# EAGLE design input output buffers DLFO (EAGLE 9.6.2)
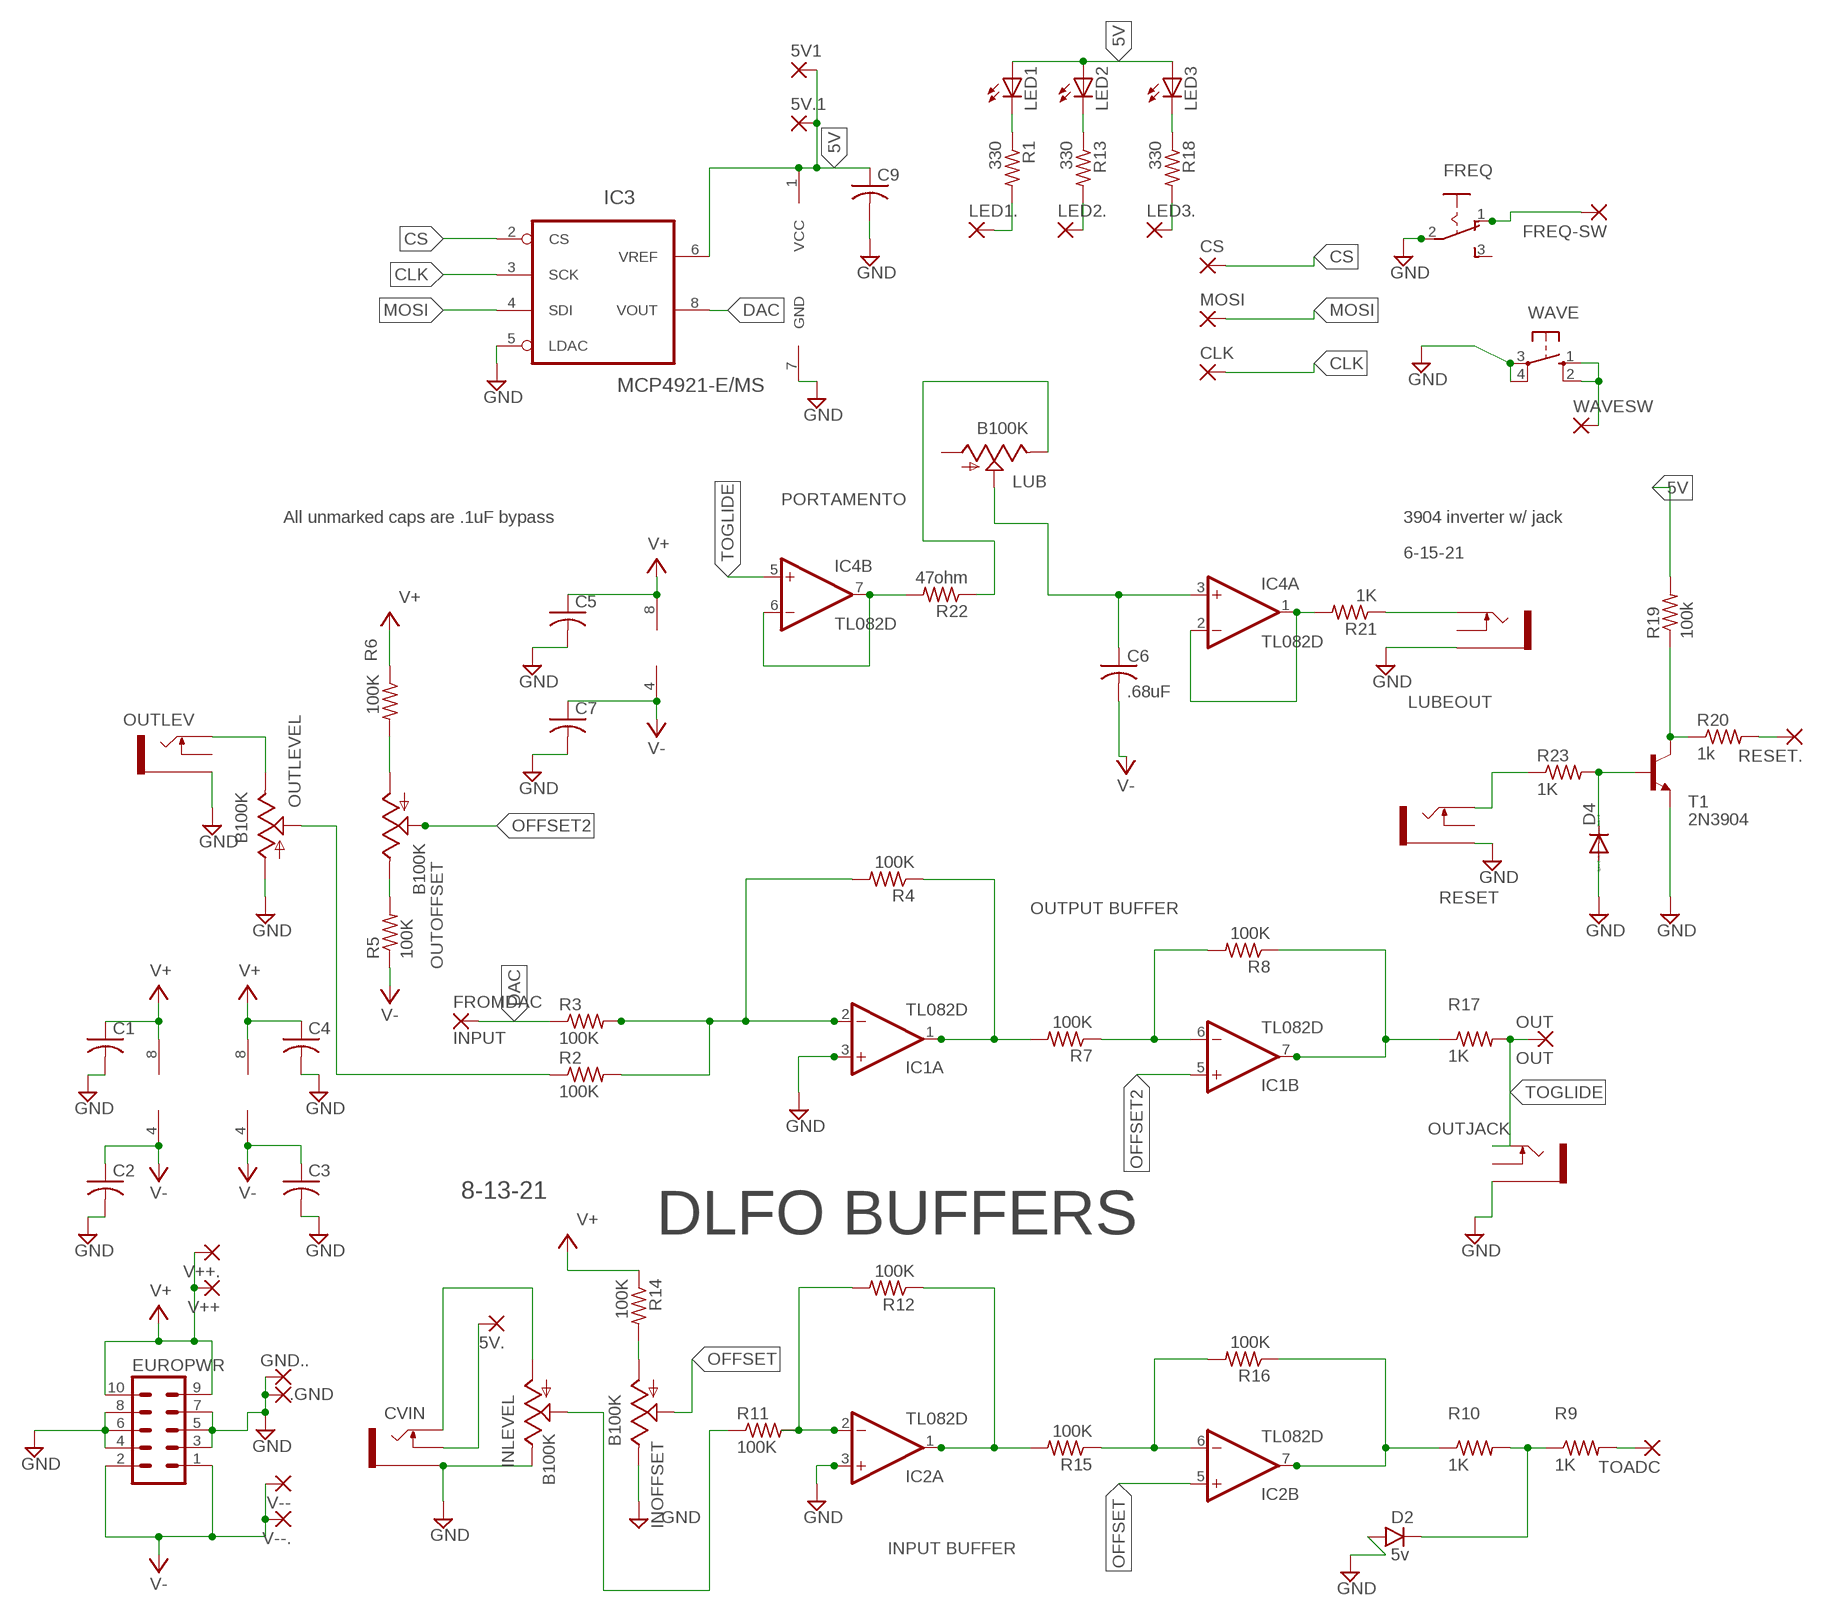
[diagram p0: schematic, sheet 1]

## Parts
5V1  WIREPAD2,54/1,0  [2,54/1,0]
5V.  3,17/1,3  [3,17/1,3]
5V.1  WIREPAD2,54/1,0  [2,54/1,0]
.GND  3,17/1,3  [3,17/1,3]
C1  C-USC0603  [C0603]
C2  C-USC0603  [C0603]
C3  C-USC0603  [C0603]
C4  C-USC0603  [C0603]
C5  C-USC0603  [C0603]
C6  .68uF  C-US050-024X044  [C050-024X044]
C7  C-USC0603  [C0603]
C9  C-USC0603  [C0603]
CLK  WIREPAD2,54/1,1  [2,54/1,1]
CS  WIREPAD2,54/1,0  [2,54/1,0]
CVIN  THONKICONNNEW  [WQP-PJ301M-12_JACK]
D2  5v  DO41.2  [DO41-2]
D4  1N4148DO35-10  [DO35-10]
EUROPWR  EURO_POWER_HEADERREGULAR  [EURO_POWER_HEADER]
FREQ  M251  [M251]
FREQ-SW  WIREPAD2,54/0,9  [2,54/0,9]
FROMDAC  INPUT  3,17/1,3  [3,17/1,3]
GND..  3,17/1,3  [3,17/1,3]
IC1  TL082D  [SO08]
IC2  TL082D  [SO08]
IC3  MCP4921-E/MS  [MSOP-8]
IC4  TL082D  [SO08]
INLEVEL  B100K  9MM_SNAP-IN_POT_  [9MM_SNAP-IN_POT]
INOFFSET  B100K  9MM_SNAP-IN_POT_  [9MM_SNAP-IN_POT]
LED1  LED3MM  [LED3MM]
LED1.  WIREPAD2,54/1,0  [2,54/1,0]
LED2  LED3MM  [LED3MM]
LED2.  WIREPAD2,54/1,0  [2,54/1,0]
LED3  LED3MM  [LED3MM]
LED3.  WIREPAD2,54/1,1  [2,54/1,1]
LUB  B100K  9MM_SNAP-IN_POT_  [9MM_SNAP-IN_POT]
LUBEOUT  THONKICONNNEW  [WQP-PJ301M-12_JACK]
MOSI  WIREPAD2,54/1,0  [2,54/1,0]
OUT  OUT  3,17/1,3  [3,17/1,3]
OUTJACK  THONKICONNNEW  [WQP-PJ301M-12_JACK]
OUTLEV  THONKICONNNEW  [WQP-PJ301M-12_JACK]
OUTLEVEL  B100K  9MM_SNAP-IN_POT_  [9MM_SNAP-IN_POT]
OUTOFFSET  B100K  9MM_SNAP-IN_POT_  [9MM_SNAP-IN_POT]
R1  330  R-US_R0603  [R0603]
R2  100K  R-US_R0603  [R0603]
R3  100K  R-US_R0603  [R0603]
R4  100K  R-US_R0603  [R0603]
R5  100K  R-US_R0603  [R0603]
R6  100K  R-US_R0603  [R0603]
R7  100K  R-US_R0603  [R0603]
R8  100K  R-US_R0603  [R0603]
R9  1K  R-US_R0603  [R0603]
R10  1K  R-US_R0603  [R0603]
R11  100K  R-US_R0603  [R0603]
R12  100K  R-US_R0603  [R0603]
R13  330  R-US_R0603  [R0603]
R14  100K  R-US_R0603  [R0603]
R15  100K  R-US_R0603  [R0603]
R16  100K  R-US_R0603  [R0603]
R17  1K  R-US_R0603  [R0603]
R18  330  R-US_R0603  [R0603]
R19  100k  R-US_R0603  [R0603]
R20  1k  R-US_R0603  [R0603]
R21  1K  R-US_R0603  [R0603]
R22  47ohm  R-US_R0603  [R0603]
R23  1K  R-US_R0603  [R0603]
RESET  THONKICONNNEW  [WQP-PJ301M-12_JACK]
RESET.  3,17/1,3  [3,17/1,3]
T1  2N3904  [TO92]
TOADC  3,17/1,3  [3,17/1,3]
V++  3,17/1,3  [3,17/1,3]
V++.  3,17/1,3  [3,17/1,3]
V--  3,17/1,3  [3,17/1,3]
V--.  3,17/1,3  [3,17/1,3]
WAVE  10-XX  [B3F-10XX]
WAVESW  WIREPAD2,54/0,9  [2,54/0,9]

## Nets
5V: 5V1.1(P) 5V.1.1(P) C9.1 IC3.1(VCC) IC3.6(VREF) LED1.A LED2.A LED3.A R19.2
CLK: CLK.1(P) IC3.3(SCK)
CS: CS.1(P) IC3.2(CS)
DAC: FROMDAC.1(P) IC3.8(VOUT) R3.1
GND: .GND.1(P) C1.2 C2.2 C3.2 C4.2 C5.2 C7.2 C9.2 CVIN.P$3_SLEEVE(SLEEVE) D2.A D4.A EUROPWR.3 EUROPWR.4 EUROPWR.5 EUROPWR.6 EUROPWR.7 EUROPWR.8 FREQ.2(P) GND...1(P) IC1.3(A:+IN) IC2.3(A:+IN) IC3.5(LDAC) IC3.7(GND) INLEVEL.3(E) INOFFSET.3(E) LUBEOUT.P$3_SLEEVE(SLEEVE) OUTJACK.P$3_SLEEVE(SLEEVE) OUTLEV.P$3_SLEEVE(SLEEVE) OUTLEVEL.1(A) RESET.P$3_SLEEVE(SLEEVE) T1.3(E) WAVE.3(P) WAVE.4(P1)
LED1: LED1..1(P) R1.2
LED2: LED2..1(P) R13.2
MOSI: IC3.4(SDI) MOSI.1(P)
N$1: OUTLEV.P$1_TIP(TIP) OUTLEVEL.3(E)
N$2: IC1.6(B:-IN) R7.1 R8.2
N$3: IC1.1(A:OUT) R4.1 R7.2
N$4: INOFFSET.1(A) R14.2
N$5: D2.C R9.1 R10.2
N$6: IC2.2(A:-IN) R11.2 R12.2
N$7: OUTLEVEL.2(S) R2.1
N$8: OUTOFFSET.1(A) R6.2
N$9: OUTOFFSET.3(E) R5.2
N$10: IC2.1(A:OUT) R12.1 R15.2
N$11: IC1.7(B:OUT) R8.1 R17.1
N$12: R23.1 RESET.P$1_TIP(TIP)
N$13: CVIN.P$1_TIP(TIP) INLEVEL.1(A)
N$14: D4.C R23.2 T1.2(B)
N$15: IC2.6(B:-IN) R15.1 R16.2
N$16: IC2.7(B:OUT) R10.1 R16.1
N$17: IC1.2(A:-IN) R2.2 R3.2 R4.2
N$18: LED3..1(P) R18.2
N$19: R9.2 TOADC.1(P)
N$20: INLEVEL.2(S) R11.1
N$21: LED1.K(C) R1.1
N$22: WAVE.1(S) WAVE.2(S1) WAVESW.1(P)
N$23: LED2.K(C) R13.1
N$24: FREQ-SW.1(P) FREQ.1(O)
N$25: LED3.K(C) R18.1
N$26: R19.1 R20.1 T1.1(C)
N$27: 5V..1(P) CVIN.P$2_SWITCH(SWITCH)
N$28: IC4.6(B:-IN) IC4.7(B:OUT) R22.2
N$29: IC4.1(A:OUT) IC4.2(A:-IN) R21.2
N$30: LUBEOUT.P$1_TIP(TIP) R21.1
N$31: LUB.3(E) R22.1
N$32: C6.1 IC4.3(A:+IN) LUB.2(S)
N$33: R20.2 RESET..1(P)
OFFSET: IC2.5(B:+IN) INOFFSET.2(S)
OFFSET2: IC1.5(B:+IN) OUTOFFSET.2(S)
TOGLIDE: IC4.5(B:+IN) OUT.1(P) OUTJACK.P$1_TIP(TIP) R17.2
V+: C1.1 C4.1 C5.1 EUROPWR.9 EUROPWR.10 IC1.8(P:V+) IC2.8(P:V+) IC4.8(P:V+) R6.1 R14.1 V++.1(P) V++..1(P)
V-: C2.1 C3.1 C6.2 C7.1 EUROPWR.1 EUROPWR.2 IC1.4(P:V-) IC2.4(P:V-) IC4.4(P:V-) R5.1 V--.1(P) V--..1(P)
Unconnected: FREQ.3(S) LUB.1(A) LUBEOUT.P$2_SWITCH(SWITCH) OUTJACK.P$2_SWITCH(SWITCH) OUTLEV.P$2_SWITCH(SWITCH) RESET.P$2_SWITCH(SWITCH)

## Notes on the sheet
- PORTAMENTO
- All unmarked caps are .1uF bypass | 3904 inverter w/ jack
- 6-15-21
- OUTPUT BUFFER
- 8-13-21
- DLFO BUFFERS
- INPUT BUFFER

## Library data of the parts
5V1 5V.1 CLK CS FREQ-SW LED1. LED2. LED3. MOSI WAVESW = wirepad:WIREPAD: Wire PAD connect wire on PCB
5V. .GND FROMDAC GND.. OUT RESET. TOADC V++ V++. V-- V--. = wirepad:3,17/1,3: THROUGH-HOLE PAD
C1-C7 C9 = rcl:C-US: CAPACITOR, American symbol; SPICEPREFIX: C
CVIN LUBEOUT OUTJACK OUTLEV RESET = MusicThingModular:THONKICONN: 3.5mm socket for Eurorack modular synths
D2 = diodes:DO41: DO-41 Package Diodes: 1N4001 - 1N40019 Zener Diodes: 1N4728 - 1N4764
D4 = diode:1N4148: DIODE high speed (Philips)
EUROPWR = MusicThingModular:EURO_POWER_HEADER: Power Header 10 pin power header for Eurorack Power Supplies Variants with fatter pads for easier soldering, and the LOCK variant which has 5mil offset pins to hold the component in place before soldering
FREQ = switch:M251: SLIDING SWITCH Mors, distributor Buerklin, 11G702
IC1 IC2 IC4 = linear:TL082: OP AMP Data sheet <http://www.ti.com/lit/ds/symlink/tl084a . pdf>; DATA_SHEET: <a href="http://www.ti.com/lit/ds/symlink/tl084a.pdf"> Data sheet </a>
IC3 = dac:MCP49*1: Digital-to-Analog Converter
INLEVEL INOFFSET LUB OUTLEVEL OUTOFFSET = MusicThingModular:9MM_SNAP-IN_POT: 9mm vertical snap-in pot, Alpha / Panasonic style
LED1-LED3 = adafruit:LED: LED OSRAM: - CHIPLED LG R971, LG N971, LY N971, LG Q971, LY Q971, LO R971, LY R971 LH N974, LH R974 LS Q976, LO Q976, LY Q976 LO Q996 - Hyper CHIPLED LW Q18S LB Q993, LB Q99A, LB R99A - SideLED LS A670, LO A670, LY A670, LG A670, LP A670 LB A673, LV A673, LT A673, LW A673 LH A674 LY A675 LS A676, LA A676, LO A676, LY A676, LW A676 LS A679, LY A679, LG A679 - Hyper Micro SIDELED® LS Y876, LA Y876, LO Y876, LY Y876 LT Y87S - SmartLED LW L88C, LW L88S LB L89C, LB L89S, LG L890 LS L89K, LO L89K, LY L89K LS L896, LA L896, LO L896, LY L896 - TOPLED LS T670, LO T670, LY T670, LG T670, LP T670 LSG T670, LSP T670, LSY T670, LOP T670, LYG T670 LG T671, LOG T671, LSG T671 LB T673, LV T673, LT T673, LW T673 LH T674 LS T676, LA T676, LO T676, LY T676, LB T676, LH T676, LSB T676, LW T676 LB T67C, LV T67C, LT T67C, LS T67K, LO T67K, LY T67K, LW E67C LS E67B, LA E67B, LO E67B, LY E67B, LB E67C, LV E67C, LT E67C LW T67C LS T679, LY T679, LG T679 LS T770, LO T770, LY T770, LG T770, LP T770 LB T773, LV T773, LT T773, LW T773 LH T774 LS E675, LA E675, LY E675, LS T675 LS T776, LA T776, LO T776, LY T776, LB T776 LHGB T686 LT T68C, LB T68C - Hyper Mini TOPLED® LB M676 - Mini TOPLED Santana® LG M470 LS M47K, LO M47K, LY M47K Source: http://www.osram.convergy.de/
R1-R23 = rcl:R-US_: RESISTOR, American symbol; SPICEPREFIX: R
T1 = transistor:2N3904: NPN TRANSISTOR
WAVE = switch-omron:10-XX: OMRON SWITCH; MPN: B3F-1000; OC_FARNELL: 176432; OC_NEWARK: 36M3542

## Board
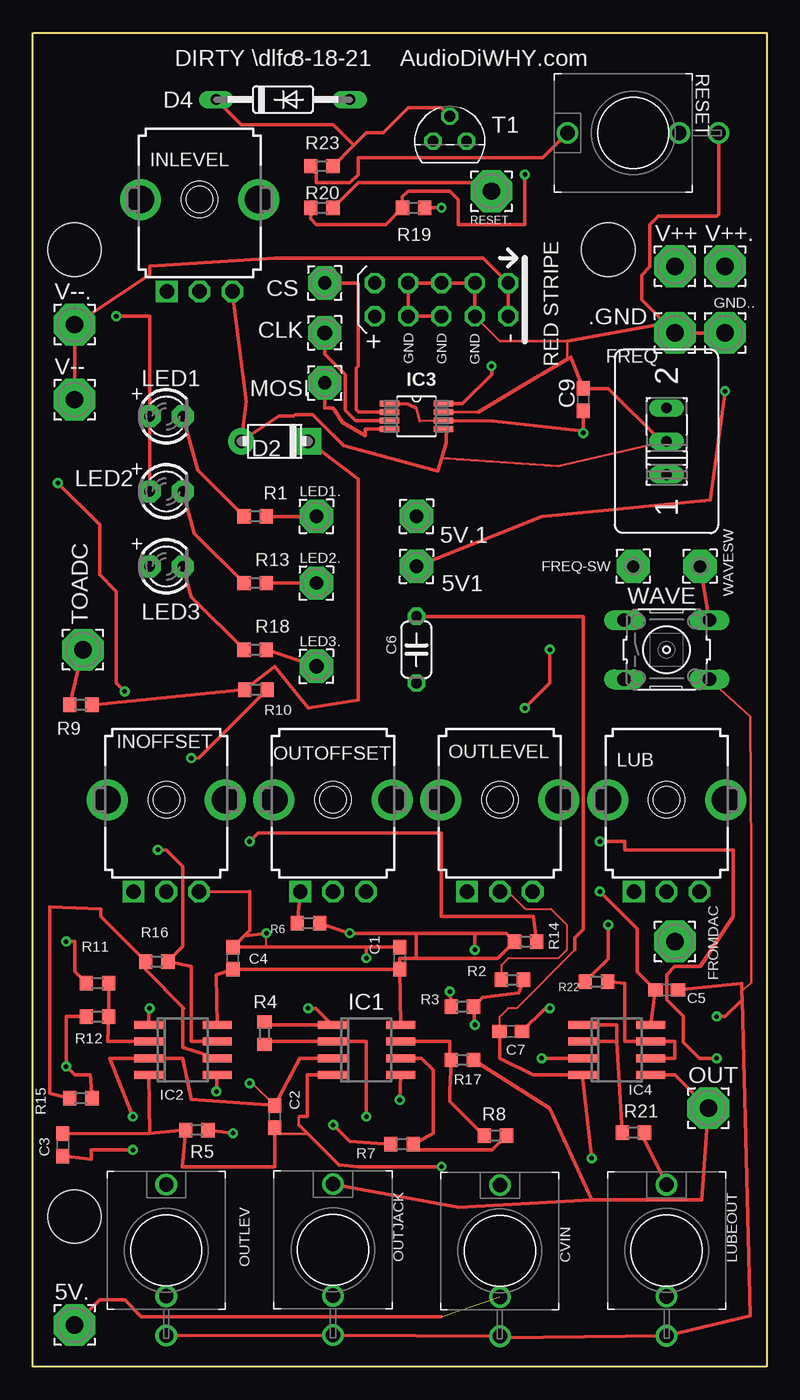
[diagram p1: board, top side]
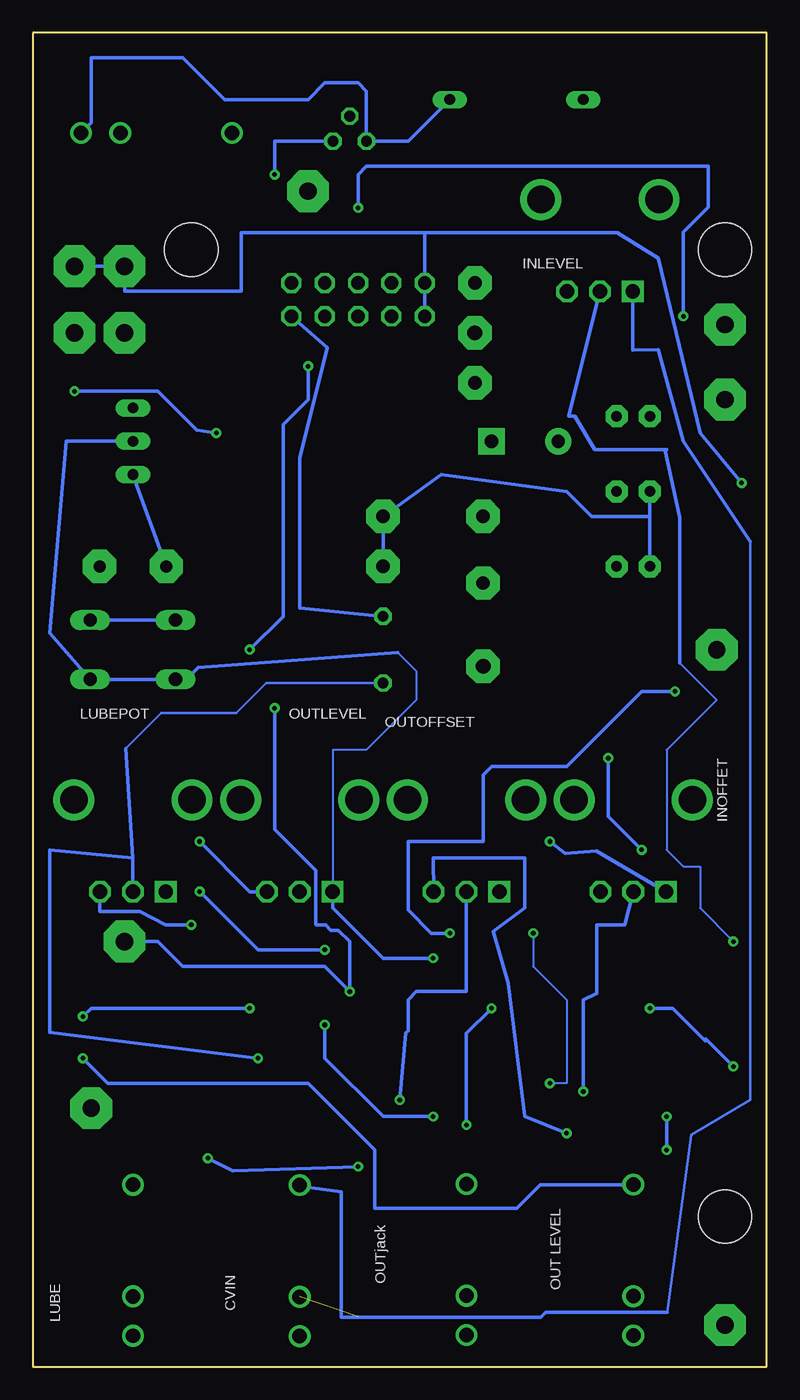
[diagram p2: board, bottom side, seen from below]

Size 55.88 x 101.6 mm. Coordinates in mm from the lower left corner, seen from the top.
Outline: 55.88,101.6 55.88,0 0,0 0,101.6 55.88,101.6
Copper layers (1*16): Top 0.035mm / dielectric 1.5mm / Bottom 0.035mm
Design rules "default": minimum track width 6mil, minimum drill 0.35mm, track to track 6mil, track to pad 6mil, pad to pad 6mil, via to via 6mil, smd to smd 6mil, copper to edge 40mil, drill to drill 6mil, minimum pad ring 10mil, minimum via ring 8mil, stop-mask expansion 4mil, vias tented up to drill 0mil, thermal gap 10mil
Holes 4.06 mm at 3.17,85.09 43.81,85.09 3.17,11.43

### Footprints (pad centres in the part's own frame; a part is rotated, then mirrored left to right if it is on the bottom)
2,54/1,0 = drill 1.016 pad 2.54 octagon: 1 0,0
3,17/1,3 = drill 1.321 pad 3.175 octagon: 1 0,0
C0603 = smd 1.1 x 1: 1 -0.85,0; 2 0.85,0
C050-024X044 = drill 0.813 octagon: 1 -2.54,0; 2 2.54,0
2,54/1,1 = drill 1.118 pad 2.54 octagon: 1 0,0
WQP-PJ301M-12_JACK = drill 1.1: P$1_TIP 0,5; P$2_SWITCH 0,-3.5; P$3_SLEEVE 0,-6.5
DO41-2 = drill 1 pad 2: A 2.54,0 | drill 1 pad 2 square: C -2.54,0
DO35-10 = drill 0.813 long: A 5.08,0; C -5.08,0
EURO_POWER_HEADER = drill 1.016 octagon: 1 -5.08,-1.27; 2 -5.08,1.27; 3 -2.54,-1.27; 4 -2.54,1.27; 5 0,-1.27; 6 0,1.27; 7 2.54,-1.27; 8 2.54,1.27; 9 5.08,-1.27; 10 5.08,1.27
M251 = drill 0.813 long: 1 -2.54,0; 2 0,0; 3 2.54,0
2,54/0,9 = drill 0.914 pad 2.54 octagon: 1 0,0
SO08 = smd 0.6 x 2.2: 1 -1.905,-2.6; 2 -0.635,-2.6; 3 0.635,-2.6; 4 1.905,-2.6; 5 1.905,2.6; 6 0.635,2.6; 7 -0.635,2.6; 8 -1.905,2.6
MSOP-8 = smd 1.499 x 0.457: 1 -2.057,0.965; 2 -2.057,0.33; 3 -2.057,-0.33; 4 -2.057,-0.965; 5 2.057,-0.965; 6 2.057,-0.33; 7 2.057,0.33; 8 2.057,0.965
9MM_SNAP-IN_POT = drill 1.1 square: 1 -2.5,-7 | drill 1.1 octagon: 2 0,-7; 3 2.5,-7 | drill 2.1 pad 2.794: CHASSIS1 -4.5,0; CHASSIS2 4.5,0
LED3MM = drill 0.813 pad 1.676 octagon: A -1.27,0; K 1.27,0
R0603 = smd 1 x 1.1: 1 -0.85,0; 2 0.85,0
TO92 = drill 0.813 octagon: 1 1.27,0; 2 0,1.905; 3 -1.27,0
B3F-10XX = drill 1.016 long: 1 -3.251,2.261; 2 3.251,2.261; 3 -3.251,-2.261; 4 3.251,-2.261

### Placement (x,y rotation side)
5V1  29.21,60.96 0 top
5V.  3.17,3.17 0 top
5V.1  29.21,64.77 0 top
.GND  48.9,78.74 0 top
C1  27.94,31.11 90 top
C2  18.41,19.05 90 top
C3  2.29,16.89 270 top
C4  15.24,31.11 90 top
C5  48.26,28.7 0 top
C6  29.21,54.61 90 top
C7  36.39,25.53 0 top
C9  41.91,73.66 90 top
CLK  22.23,78.74 0 top
CS  22.23,82.55 0 top
CVIN  35.56,8.82 0 top
D2  18.41,70.48 180 top
D4  19.05,96.52 0 top
EUROPWR  31.11,81.28 180 top
FREQ  48.26,70.48 90 top
FREQ-SW  45.72,60.96 0 top
FROMDAC  48.9,32.38 0 top
GND..  52.7,78.74 0 top
IC1  25.4,24.13 270 top
IC2  11.43,24.13 270 top
IC3  29.21,72.39 0 top
IC4  44.45,24.13 270 top
INLEVEL  12.7,88.9 0 top
INOFFSET  10.16,43.18 0 top
LED1  10.16,72.39 0 top
LED1.  21.59,64.77 0 top
LED2  10.16,66.67 0 top
LED2.  21.59,59.69 0 top
LED3  10.16,60.96 0 top
LED3.  21.59,53.34 0 top
LUB  48.26,43.18 0 top
LUBEOUT  48.26,8.86 0 top
MOSI  22.23,74.93 0 top
OUT  51.44,19.68 0 top
OUTJACK  22.86,8.9 0 top
OUTLEV  10.16,8.87 0 top
OUTLEVEL  35.56,43.18 0 top
OUTOFFSET  22.86,43.18 0 top
R1  16.93,64.77 0 top
R2  36.51,29.46 0 top
R3  32.7,27.43 0 top
R4  17.65,25.4 270 top
R5  12.48,18.03 0 top
R6  20.99,33.78 180 top
R7  28.11,16.95 180 top
R8  35.22,17.59 0 top
R9  3.66,50.42 180 top
R10  16.99,51.56 180 top
R11  4.93,29.21 0 top
R12  4.93,26.67 0 top
R13  16.93,59.69 0 top
R14  37.53,32.38 0 top
R15  3.66,20.45 0 top
R16  9.44,30.86 180 top
R17  32.7,23.37 0 top
R18  16.93,54.61 0 top
R19  29,88.27 0 top
R20  22.01,88.27 0 top
R21  45.72,17.84 180 top
R22  42.93,29.34 0 top
R23  22.01,91.44 0 top
RESET  45.72,93.98 90 top
RESET.  34.92,89.53 180 top
T1  31.75,93.34 0 top
TOADC  3.81,54.61 0 top
V++  48.9,83.82 0 top
V++.  52.7,83.82 0 top
V--  3.17,73.66 0 top
V--.  3.17,79.38 0 top
WAVE  48.26,54.61 0 top
WAVESW  50.8,60.96 0 top

### Tracks (layer width: path | path; a pad name or v marks a point on that pad's centre or on a via)
5V  (via drill 0.35)
  Top 0.203: IC3.6 29.46,72.01 29.21,73.03
  Top 0.254: IC3.6 35.06,72.02 41.94,71.25 v41.91,71.12 C9.1 | IC3.1 28.56,73.31 29.21,73.03 | 5V1.1 38.73,64.77 51.6,66 v52.7,74.3 | LED2.A LED1.A 8.89,80.01 v6.35,80.01 | R19.2 v31.11,88.27
  Bottom 0.254: v41.91,71.12 43.41,71.35 46.35,74.3 v52.7,74.3 | 5V1.1 5V.1.1 24.77,67.94 15.24,66.67 13.34,64.77 8.89,64.77 | 8.89,64.77 LED2.A | LED3.A 8.89,64.77 | v31.11,88.27 31.11,90.81 30.48,91.44 4.45,91.44 4.45,88.31 6.35,86.41 v6.35,80.01
CLK
  Top 0.254: IC3.3 24.59,72.06 23.77,72.87 23.77,75.57 22.23,77.12 CLK.1
CS
  Top 0.254: IC3.2 24.82,72.72 24.64,72.9 24.64,76.07 24.77,76.2 24.77,82.55 CS.1
DAC  (via drill 0.35)
  Top 0.254: v31.75,28.57 31.8,27.94 31.82,27.46 R3.1 | v39.37,54.61 39.37,52.07 v37.47,50.16 | IC3.8 32.72,73.36 34.92,75.56 v34.92,76.2
  Bottom 0.254: FROMDAC.1 46.35,32.38 44.45,30.48 33.66,30.48 v31.75,28.57 31.75,32.38 32.61,33.25 33.19,33.25 33.59,33.66 34.29,33.66 34.33,33.69 34.33,37.78 37.47,40.92 v37.47,50.16 | v39.37,54.61 36.83,57.15 36.83,71.75 34.92,73.66 v34.92,76.2
GND  (via drill 0.35)
  Top 0.152: C2.2 16.73,21.59 v16.51,21.59 | 17.78,31.96 v17.78,33.02
  Top 0.203: FREQ.2 40.01,68.58 31.12,69.21 | 40.69,76.75 40.69,78.11 35.56,78.11 EUROPWR.4 | 33.9,72.72 IC3.7 | 53.99,28.57 54.69,29.27 54.69,38.73 54.61,49.53 WAVE.4
  Top 0.254: 16.09,32.81 C4.2 17.78,31.96 25.4,31.96 | 16.09,32.81 16.51,33.23 16.51,36.2 INOFFSET.3 | C3.2 4.45,15.81 4.45,16.51 v7.62,16.51 | v7.62,19.05 5.84,23.5 IC2.3 11.43,23.5 12.06,20.37 C2.2 20.32,23.5 IC1.3 | OUTLEV.P$3_SLEEVE OUTJACK.P$3_SLEEVE CVIN.P$3_SLEEVE 35.7,2.19 LUBEOUT.P$3_SLEEVE 54.61,3.87 54.01,27.94 | FREQ.2 47.84,70.48 43.81,74.51 C9.2 40.96,76.91 40.69,76.75 38.72,75.57 38.62,75.52 38.5,75.44 33.9,72.72 | EUROPWR.4 EUROPWR.3 EUROPWR.5 EUROPWR.7 EUROPWR.8 EUROPWR.6 | IC3.5 31.48,71.21 31.48,70.37 31.12,69.21 30.81,68.2 23.69,70.14 21.31,72.53 19.97,72.53 19.83,72.39 18.73,72.39 D2.A 16.26,73.52 INLEVEL.3 | 54.01,27.94 53.99,28.57 53.98,29.21 C5.2 | 54.01,27.94 52.74,26.67 v52.07,26.67 | v39.37,27.3 39.01,27.3 C7.2 | C1.2 25.4,31.96 | 25.4,31.96 v25.4,31.11 | v17.78,33.02 16.09,32.81 | 40.69,78.11 47.62,79.38 .GND.1 | .GND.1 GND...1 | .GND.1 46.35,81.28 46.35,83.14 46.99,83.78 46.99,87 47.62,87.63 52.07,87.63 52.22,87.78 RESET.P$3_SLEEVE
  Bottom 0.152: v17.78,33.02 17.78,30.48 15.24,27.94 15.24,21.59 v16.51,21.59 | 28.1,54.41 26.67,52.98 26.67,50.8 30.48,46.99 33.02,46.99 33.03,46.98 33.03,36.2
  Bottom 0.254: v7.62,16.51 v7.62,19.05 | OUTLEVEL.1 33.03,36.2 33.03,34.93 29.21,31.11 v25.4,31.11 | 28.1,54.41 43.27,53.24 44.45,52.07 WAVE.3 WAVE.4 54.61,55.88 53.34,70.48 FREQ.2 | v52.07,26.67 51.44,27.3 v39.37,27.3 | D4.A 27.3,93.34 T1.3 30.48,97.16 31.11,97.79 33.66,97.79 34.92,96.52 41.27,96.52 44.45,99.69 51.44,99.69 51.44,94.77 RESET.P$3_SLEEVE
LED1
  Top 0.254: R1.2 LED1..1
LED2
  Top 0.254: R13.2 LED2..1
MOSI
  Top 0.254: IC3.4 25.3,71.42 25.3,70.94 23.59,71.93 22.95,72.9 22.86,73.03 22.23,73.03 MOSI.1
N$1  (via drill 0.35)
  Top 0.254: v52.07,23.5 50.74,23.5 49.53,24.7 49.53,26.67 48.26,27.94 48.26,29.84 48.9,30.48 50.8,30.48 53.34,34.29 53.34,39.37 45.09,39.37 45.09,40.01 v43.18,40.01
  Bottom 0.254: OUTLEV.P$1_TIP 17.25,13.87 19.05,12.06 29.84,12.06 29.84,16.51 34.92,21.59 50.16,21.59 v52.07,23.5 | v43.18,40.01 39.35,36.18 OUTLEVEL.3
N$2
  Top 0.254: R8.2 34.99,16.51 29.4,16.51 R7.1 30.49,17.76 30.49,22.59 29.59,23.5 IC1.6
N$3  (via drill 0.35)
  Top 0.254: R4.1 17.94,26.04 IC1.1 21.53,27.3 v20.95,27.3 | R7.2 24.13,17.14 v22.86,18.41
  Bottom 0.254: v20.95,27.3 22.86,25.4 v22.86,18.41
N$4  (via drill 0.35)
  Top 0.254: R14.2 38.1,34.29 31.11,34.29 31.11,40.64 17.14,40.64 v16.51,40.01
  Bottom 0.254: v16.51,40.01 15.34,39.11 12.98,39.27 INOFFSET.1
N$5
  Top 0.254: R9.1 R10.2 18.41,53.34 20.95,50.16 24.77,50.8 24.77,67.63 D2.C
N$6
  Top 0.254: R11.2 R12.2 5.71,24.77 IC2.2
N$7
  Top 0.152: OUTLEVEL.2 36.19,36.18 37.5,34.87 39.42,34.87 40.64,33.66 40.64,31.75 40.01,31.11 36.2,31.11 35.66,30.58 R2.1
N$8
  Top 0.254: R6.2 OUTOFFSET.1
N$9  (via drill 0.35)
  Top 0.254: R5.2 v15.24,17.78
  Bottom 0.254: v15.24,17.78 18.41,19.05 19.68,29.21 20.81,33.16 18.41,34.96 18.41,38.73 25.4,38.73 OUTOFFSET.3
N$10  (via drill 0.35)
  Top 0.254: R15.2 4.39,22.21 3.19,22.21 v2.54,22.86 2.54,26.67 R12.1 | v8.89,27.3 8.83,27.25 IC2.1
  Bottom 0.254: v2.54,22.86 4.63,24.95 4.68,24.82 7.16,27.3 v8.89,27.3
N$11
  Top 0.254: IC1.7 31.75,24.77 31.75,24.13 31.69,23.53 R17.1 31.75,20.95 31.75,20.21 R8.1
N$12
  Top 0.254: R23.1 21.59,91.01 21.59,90.17 24.13,90.17 24.77,90.81 24.77,92.08 38.81,92.08 RESET.P$1_TIP
N$13
  Bottom 0.203: 7.59,4.14 5.73,17.64 1.27,20.32 1.27,62.87
  Bottom 0.254: 7.59,4.14 16.82,4.14 17.2,3.76 32.38,3.76 32.38,13.34 36.06,13.79 CVIN.P$1_TIP | INLEVEL.1 10.2,77.41 8.26,77.47 6.35,70.48 1.27,62.87
N$14
  Top 0.254: R23.2 24.45,93.03 | 24.45,93.03 25.4,93.98 26.67,93.98 28.57,95.89 31.11,95.89 T1.2 | 24.45,93.03 22.86,94.61 15.88,94.61 D4.C
N$15
  Top 0.254: R15.1 1.27,20.81 1.27,35.01 5.16,34.88 5.16,34.29 R16.2 8.59,30.23 11.51,27.3 11.43,27.3 11.43,24.34 IC2.6
N$16  (via drill 0.35)
  Top 0.254: IC2.7 12.06,24.77 12.06,30.48 R16.1 11.43,32 11.43,38.1 10.16,39.37 v9.53,39.37 | R10.1 12.64,46.35 v12.06,46.35
  Bottom 0.254: v12.06,46.35 12.06,41.91 v9.53,39.37
N$17  (via drill 0.35)
  Top 0.254: R4.2 17.95,24.77 IC1.2 25.4,24.77 v25.4,19.05 | v33.66,26.04 33.59,27.4 R3.2 34.27,28.15 37.01,28.45 R2.2
  Bottom 0.254: v25.4,19.05 29.21,19.05 33.66,23.5 v33.66,26.04
N$18
  Top 0.254: R18.2 LED3..1
N$19
  Top 0.254: R9.2 TOADC.1
N$20  (via drill 0.35)
  Top 0.254: R11.1 3.17,30.11 3.17,32.38 v2.54,32.38
  Bottom 0.152: 6.6,53.59 3.81,50.8 7.62,46.99 7.62,39.37 6.35,38.1 5.08,38.1 5.08,34.92 v2.54,32.38
  Bottom 0.254: INLEVEL.2 15.06,72.39 14.61,72.39 13.08,69.85 7.62,69.85 7.73,69.74 6.64,64.69 6.6,53.59
N$21
  Top 0.254: LED1.K 12.55,68.3 R1.1
N$22
  Top 0.254: WAVE.2 WAVESW.1
  Bottom 0.254: WAVE.2 WAVE.1
N$23
  Top 0.254: R13.1 12.31,63.46 LED2.K
N$24
  Bottom 0.254: FREQ-SW.1 FREQ.1
N$25
  Top 0.254: R18.1 12.07,58.62 LED3.K
N$26  (via drill 0.35)
  Top 0.254: R20.1 21.16,87.42 21.59,87 26.88,87 R19.1 28.14,89.11 28.57,89.53 31.75,89.53 32.38,88.9 32.38,87 37.47,87 v37.47,90.81
  Bottom 0.254: v37.47,90.81 37.47,93.34 T1.1
N$27  (1 unrouted)
  Top 0.254: 5V..1 5.08,5.08 6.99,5.08 8.26,3.81 31.11,3.81
N$28
  Top 0.254: IC4.6 48.9,23.5 48.9,24.77 IC4.7 45.09,24.77 45.09,29.21 R22.2
N$29
  Top 0.254: R21.2 44.45,24.77 | IC4.2 44.45,24.77 | 44.45,24.77 44.45,26.04 IC4.1
N$30
  Top 0.254: LUBEOUT.P$1_TIP 46.57,17.32 R21.1
N$31  (via drill 0.35)
  Top 0.254: v43.81,33.66 43.81,31.08 R22.1
  Bottom 0.254: v43.81,33.66 45.76,33.66 47.73,34.67 50.79,34.67 LUB.3
N$32  (via drill 0.35)
  Top 0.254: IC4.3 v38.73,23.5
  Bottom 0.203: 48.82,47.07 46.1,49.78 40.39,49.78 38.1,52.07 C6.1
  Bottom 0.254: v38.73,23.5 54.61,25.48 54.61,39.37 48.26,38.73 | 48.26,38.73 LUB.2 | 48.26,38.73 48.82,47.07
N$33
  Top 0.254: R20.2 24.77,90.17 34.29,90.17 RESET..1
OFFSET  (via drill 0.35)
  Top 0.254: IC2.5 v13.97,20.95
  Bottom 0.254: v13.97,20.95 13.97,27.94 12.95,28.45 12.95,33.66 10.79,33.66 INOFFSET.2
OFFSET2  (via drill 0.35)
  Top 0.254: IC1.5 v27.94,20.32
  Bottom 0.254: v27.94,20.32 27.48,25.42 27.3,25.59 27.3,27.94 26.67,28.57 22.86,28.57 OUTOFFSET.2
TOGLIDE
  Top 0.254: IC4.5 48.9,22.23 OUT.1 50.94,12.7 42.55,12.7 | R17.2 39.37,19.68 42.55,12.7 | OUTJACK.P$1_TIP 32.42,12.14 42.55,12.7
V+  (via drill 0.35)
  Top 0.254: IC4.8 C5.1 46.41,29.71 46.39,29.71 46.01,30.09 46.01,33.36 v43.18,36.2 | IC2.8 13.96,29.84 C4.1 C1.1 | IC1.8 C1.1 | 29.21,31.11 35.41,31.11 R14.1 36.04,33.02 33.66,33.02 | 29.21,31.11 27.94,31.11 C1.1 | 33.66,33.02 29.21,33.02 | 33.66,33.02 v33.66,31.75 | v1.91,67.31 5.08,64.14 5.08,60.33 6.35,59.05 6.35,52.07 v6.99,51.44 | R6.1 v24.13,33.02 29.21,33.02 | 29.21,31.11 29.21,33.02
  Bottom 0.254: v43.18,36.2 38.73,31.75 v33.66,31.75 | EUROPWR.10 EUROPWR.9 26.04,86.36 | v6.99,51.44 9.53,51.44 15.24,45.72 20.95,45.72 21.59,45.09 21.59,40.01 27.3,40.01 27.3,34.8 25.53,33.02 v24.13,33.02 | 26.04,86.36 11.38,86.36 8.26,84.45 5.08,71.12 v1.91,67.31 | 26.04,86.36 40.01,86.36 40.01,81.92 48.9,81.92 V++.1 V++..1
V-  (via drill 0.35)
  Top 0.152: 41.25,31.73 36.83,27.3 36.2,27.3 35.53,26.64 C7.1
  Top 0.203: 20.32,19.05 20.26,18.99 20.26,18.41 | C2.1 18.86,17.75 20.93,17.75
  Top 0.254: C7.1 35.55,23.5 38.1,22.23 IC4.4 v42.55,15.88 | IC2.4 8.89,17.78 | 8.89,17.78 R5.1 11.37,15.24 18.41,15.24 C2.1 | C3.1 8.89,17.78 | v31.11,15.24 24.77,15.24 23.3,15.37 20.93,17.75 20.26,18.41 | IC1.4 20.89,22.23 20.89,19.05 20.32,19.05 | C6.2 41.91,57.15 41.91,33.31 41.25,32.66 41.25,31.73 | V--.1 V--..1 8.89,83.19 8.89,83.82 18.41,84.45 34.29,84.45 EUROPWR.1 EUROPWR.2
  Bottom 0.254: v31.11,15.24 40.64,14.92 v42.55,15.88 | C6.2 35.56,57.78 35.56,69.22 33.46,77.62 EUROPWR.2

### Text on the board
tNames: DIRTY \dlfo | 8-18-21 | AudioDiWHY.com
bNames: INLEVEL | OUTOFFSET | OUTLEVEL | LUBEPOT | INOFFET | OUT LEVEL | OUTjack | CVIN | LUBE